# Altium schematic sheet Sh3_Power.SchDoc
size A3
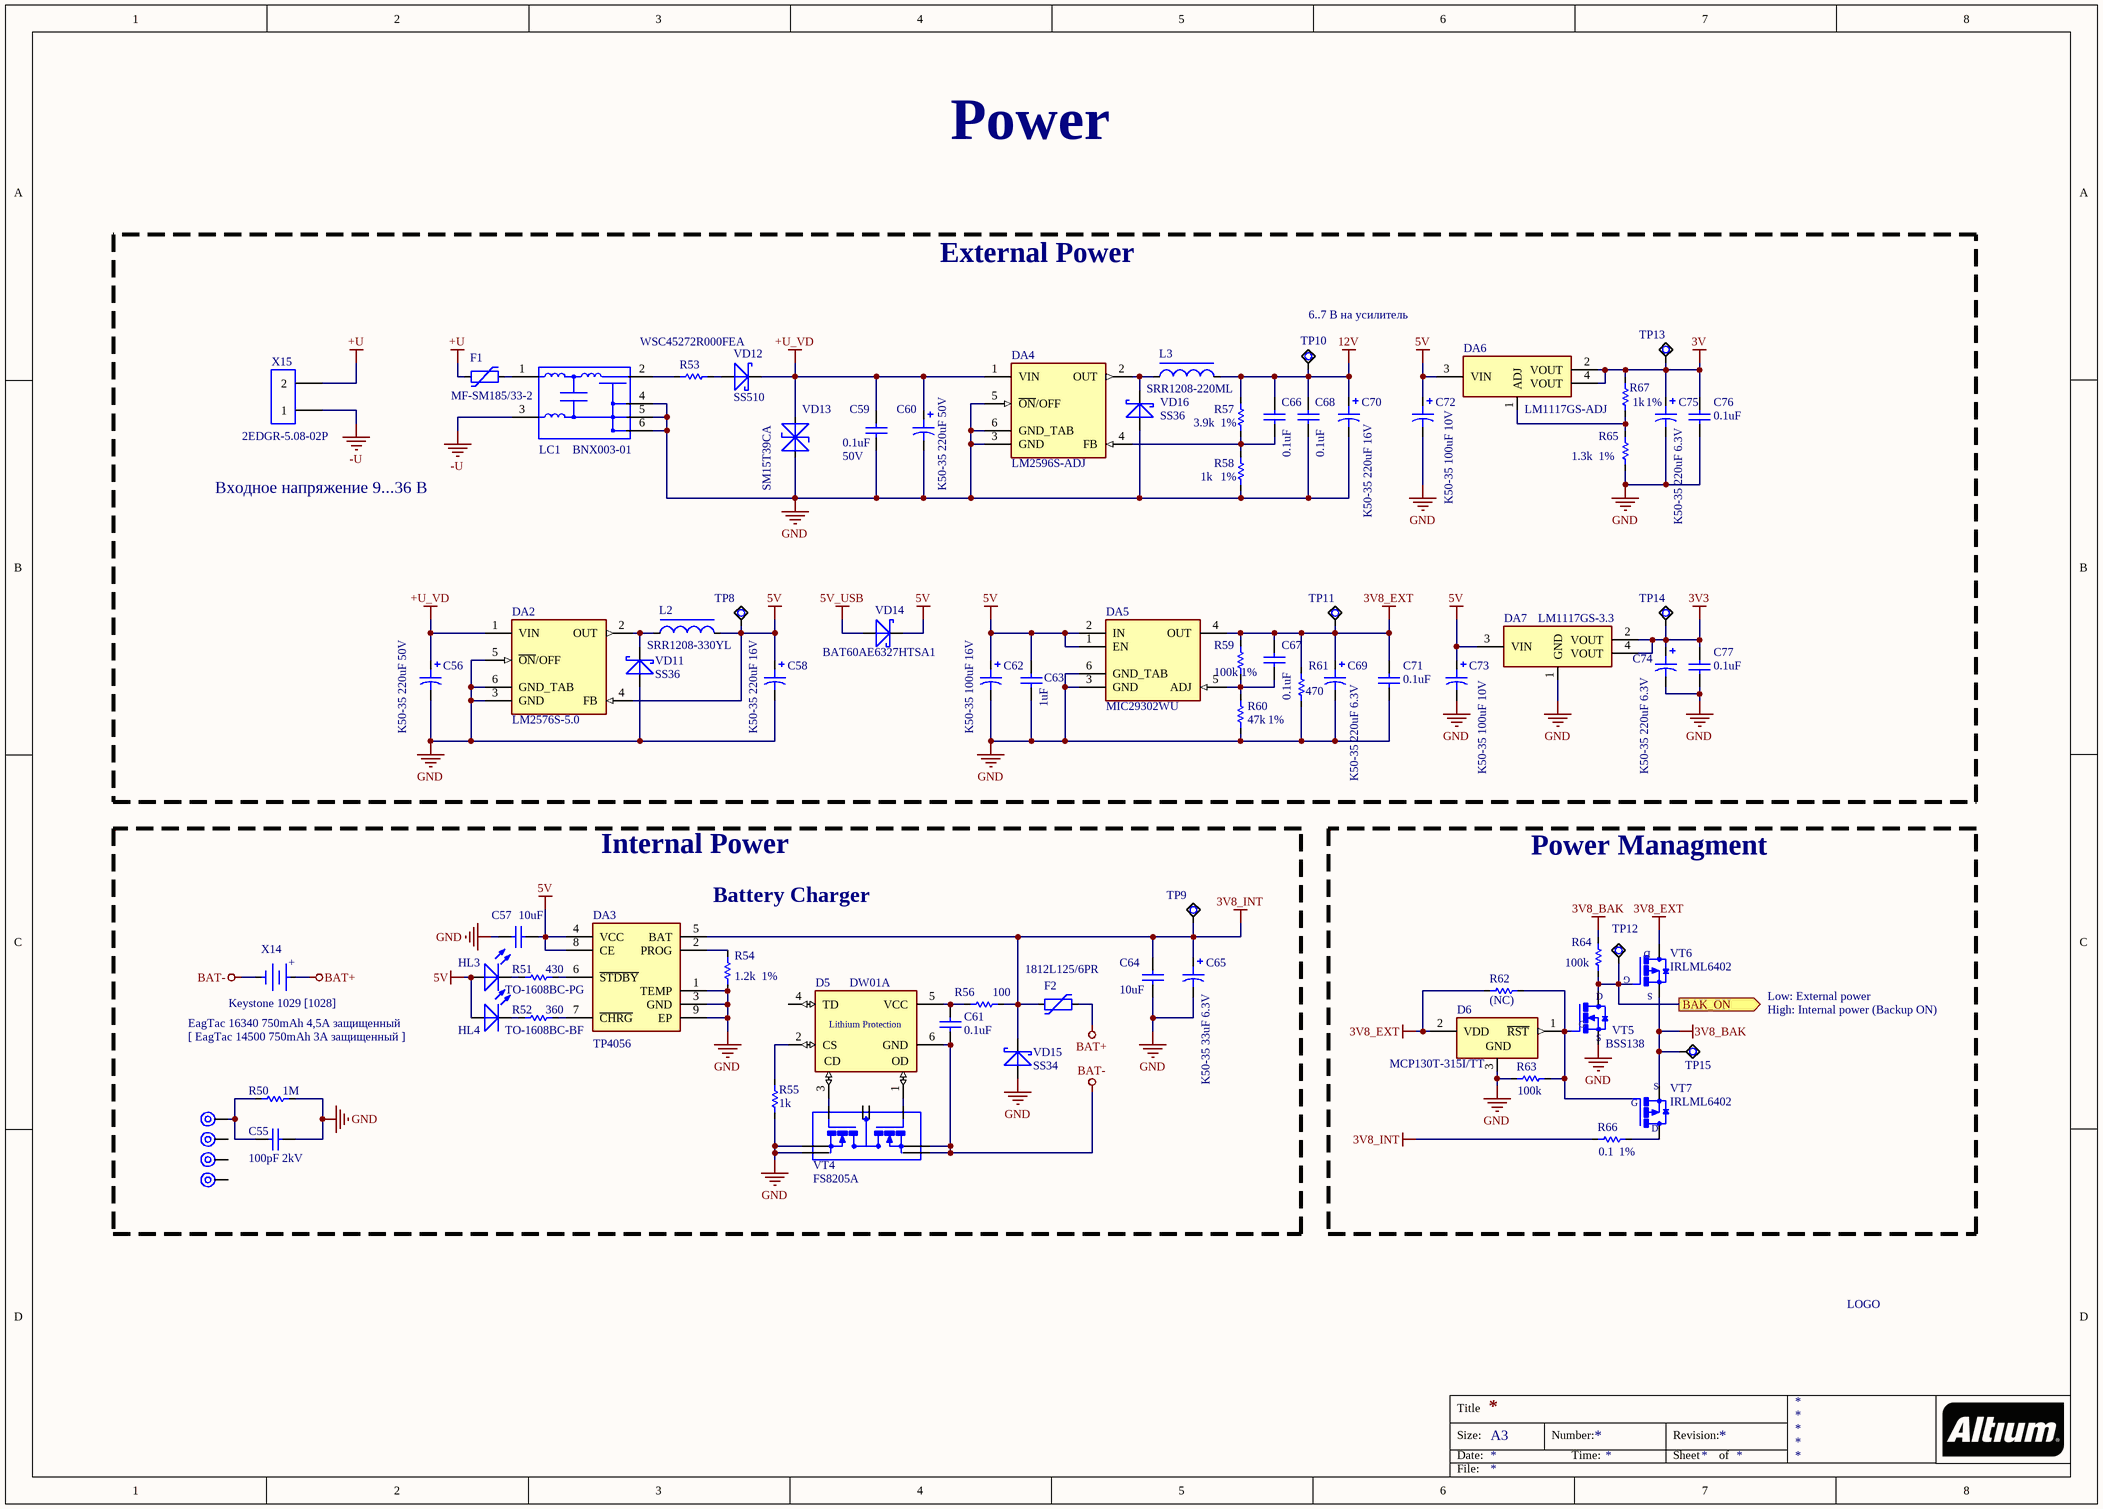
[diagram p0: Sh3_Power.SchDoc]

## Parts
BC1  Mounting Hole  [body_connection_1]  (value not drawn)
BC2  Mounting Hole  [body_connection_1]  (value not drawn)
BC3  Mounting Hole  [body_connection_1]  (value not drawn)
BC4  Mounting Hole  [body_connection_1]  (value not drawn)
C55  100pF 2kV  [C_SMD1206]
C56  K50-35 220uF 50V  [K50-35 10x12.5x5]
C57  10uF  [C_SMD0603]
C58  K50-35 220uF 16V  [K50-35 6.3x11x2.5]
C59  0.1uF  [C_SMD0603]
C60  K50-35 220uF 50V  [K50-35 10x12.5x5]
C61  0.1uF  [C_SMD0603]
C62  K50-35 100uF 16V  [K50-35 6.3x11x2.5]
C63  1uF  [C_SMD0603]
C64  10uF  [C_SMD0603]
C65  K50-35 33uF 6.3V  [K50-35mini 4x7x2]
C66  0.1uF  [C_SMD0603]
C67  0.1uF  [C_SMD0603]
C68  0.1uF  [C_SMD0603]
C69  K50-35 220uF 6.3V  [K50-35 6.3x11x2.5]
C70  K50-35 220uF 16V  [K50-35 6.3x11x2.5]
C71  0.1uF  [C_SMD0603]
C72  K50-35 100uF 10V  [K50-35 5x11x2]
C73  K50-35 100uF 10V  [K50-35 5x11x2]
C74  K50-35 220uF 6.3V  [K50-35 6.3x11x2.5]
C75  K50-35 220uF 6.3V  [K50-35 6.3x11x2.5]
C76  0.1uF  [C_SMD0603]
C77  0.1uF  [C_SMD0603]
D5  DW01A  [SOT23-6-D]
D6  MCP130T-315I/TT  [SOT23-3]
DA2  LM2576S-5.0  [TO263-5]
DA3  TP4056  [SOIC127P600X175-9N]
DA4  LM2596S-ADJ  [TO263-5]
DA5  MIC29302WU  [TO263-5 - heatsink]
DA6  LM1117GS-ADJ  [SOT223]
DA7  LM1117GS-3.3  [SOT223]
F1  MF-SM185/33-2  [FUSM8867X300N]
F2  1812L125/6PR  [FUSSC324X455X62L]
HL3  TO-1608BC-PG  [LED_SMD1608GREEN]
HL4  TO-1608BC-BF  [LED_SMD1608]
L2  SRR1208-330YL  [SRR1208]
L3  SRR1208-220ML  [SRR1208]
LC1  BNX003-01  [Murata_BNX_L12MM5_W11MM5_T13MM0_MFG]
N1  Logo  [LOGO_SS]  (value not drawn)
R50  1M  [R_SMD1206]
R51  430  [R_SMD0603]
R52  360  [R_SMD0603]
R53  WSC45272R000FEA  [R_SMD4527]
R54  1.2k  [R_SMD0603]
R55  1k  [R_SMD0603]
R56  100  [R_SMD0603]
R57  3.9k  [R_SMD0603]
R58  1k  [R_SMD0603]
R59  100k  [R_SMD0603]
R60  47k  [R_SMD0603]
R61  470  [R_SMD0805]
R62  (NC)  [R_SMD0603]
R63  100k  [R_SMD0603]
R64  100k  [R_SMD0603]
R65  1.3k  [R_SMD0603]
R66  0.1  [R_SMD0805]
R67  1k  [R_SMD0603]
TP8  Test_point  [TEST_POINT]  (value not drawn)
TP9  Test_point  [TEST_POINT]  (value not drawn)
TP10  Test_point  [TEST_POINT]  (value not drawn)
TP11  Test_point  [TEST_POINT]  (value not drawn)
TP12  Test_point  [TEST_POINT]  (value not drawn)
TP13  Test_point  [TEST_POINT]  (value not drawn)
TP14  Test_point  [TEST_POINT]  (value not drawn)
TP15  Test_point  [TEST_POINT]  (value not drawn)
VD11  SS36  [DO214AB SMC]
VD12  SS510  [SMC]
VD13  SM15T39CA  [DO214AB SMC]
VD14  BAT60AE6327HTSA1  [SOD-323]
VD15  SS34  [DO214AB SMC]
VD16  SS36  [DO214AB SMC]
VT4  FS8205A  [SOP65P640X120-8N]
VT5  BSS138  [SOT23-3]
VT6  IRLML6402  [SOT23]
VT7  IRLML6402  [SOT23]
X14  Keystone 1029 [1028]  [BAT_keystone1028+1029]
X15  2EDGR-5.08-02P  [2EDGR-5.08-02P]

## Blocks framed on the sheet
External Power: C56 C58-C60 C62 C63 C66-C77 DA2 DA4-DA7 F1 L2 L3 LC1 R53 R57-R61 R65 R67 TP8 TP10 TP11 TP13 TP14 VD11-VD14 VD16 X15
Internal Power: BC1-BC4 C55 C57 C61 C64 C65 D5 DA3 F2 HL3 HL4 R50-R52 R54-R56 TP9 VD15 VT4 X14
Power Managment: D6 R62-R64 R66 TP12 TP15 VT5-VT7

## Ports
BAK_ON (out)

## Nets
3V: C75.1 C76.1 DA6.2(VOUT) DA6.4(VOUT) R67.2(CW) TP13.1
3V3: C74.1 C77.1 DA7.2(VOUT) DA7.4(VOUT) TP14.1
3V8_BAK: R64.1(CCW) TP15.1 VT6.2(S) VT7.2(S)
3V8_EXT: C67.1 C69.1 C71.1 D6.2(VDD) DA5.4(OUT) R59.2(CW) R61.2(CW) R62.2(CW) TP11.1 VT6.3(D)
3V8_INT: C64.1 C65.1 DA3.5(BAT) F2.1 R56.1(CCW) R66.2(CW) TP9.1 VD15.2(NEG)
5V: C57.2 C58.1 C62.1 C63.1 C72.1 C73.1 DA2.4(FB) DA3.4(VCC) DA3.8(CE) DA5.1(EN) DA5.2(IN) DA6.3(VIN) DA7.3(VIN) HL3.1(POS) HL4.1(POS) L2.2 TP8.1 VD14.2(NEG)
5V_USB: VD14.1(POS)
12V: C66.1 C68.1 C70.1 L3.2 R57.2(CW) TP10.1
+U: F1.1 X15.2
+U_VD: C56.1 C59.1 C60.1 DA2.1(VIN) DA4.1(VIN) VD12.C(NEG) VD13.2(K)
-U: LC1.3(PSG) X15.1
BAT+: F2.2 X14.POS
BAT-: C61.2 D5.6(GND) VT4.2(S1_1) VT4.3(S1_2) X14.NEG
GND: C55.2 C56.2 C57.1 C58.2 C59.2 C60.2 C62.2 C63.2 C64.2 C65.2 C68.2 C69.2 C70.2 C71.2 C72.2 C73.2 C74.2 C75.2 C76.2 C77.2 D6.3(VSS) DA2.3(GND) DA2.5(~{ON}/OFF) DA2.6(GND_TAB) DA3.1(TEMP) DA3.3(GND) DA3.9(EP) DA4.3(GND) DA4.5(~{ON}/OFF) DA4.6(GND_TAB) DA5.3(GND) DA5.6(GND_TAB) DA7.1(GND) LC1.4(CG) LC1.5(CG) LC1.6(CG) R50.2(CW) R54.1(CCW) R55.2(CW) R58.1(CCW) R60.1(CCW) R61.1(CCW) R63.2(CW) R65.1(CCW) VD11.1(POS) VD13.1(A) VD15.1(POS) VD16.1(POS) VT4.6(S2_1) VT4.7(S2_2) VT5.2(S)
BAK_ON: R64.2(CW) TP12.1 VT5.3(D) VT6.1(G) ; port BAK_ON
NetBC1_1: BC1.1 C55.1 R50.1(CCW)
NetC61_1: C61.1 D5.5(VCC) R56.2(CW)
NetC66_2: C66.2 DA4.4(FB) R57.1(CCW) R58.2(CW)
NetC67_2: C67.2 DA5.5(ADJ) R59.1(CCW) R60.2(CW)
NetD5_1: D5.1(OD) VT4.4(G1)
NetD5_2: D5.2(CS) R55.1(CCW)
NetD5_3: D5.3(OC) VT4.5(G2)
NetD6_1: D6.1(~{RST}) R62.1(CCW) R63.1(CCW) VT5.1(G) VT7.1(G)
NetDA2_2: DA2.2(OUT) L2.1 VD11.2(NEG)
NetDA3_2: DA3.2(PROG) R54.2(CW)
NetDA3_6: DA3.6(~{STDBY}) R51.1(CCW)
NetDA3_7: DA3.7(~{CHRG}) R52.1(CCW)
NetDA4_2: DA4.2(OUT) L3.1 VD16.2(NEG)
NetDA6_1: DA6.1(ADJ) R65.2(CW) R67.1(CCW)
NetF1_2: F1.2 LC1.1(B)
NetHL3_2: HL3.2(NEG) R51.2(CW)
NetHL4_2: HL4.2(NEG) R52.2(CW)
NetLC1_2: LC1.2(CB) R53.1(CCW)
NetR53_2: R53.2(CW) VD12.A(POS)
NetR66_1: R66.1(CCW) VT7.3(D)

Not connected (* = marked no-connect by the designer): BC2 1; BC3 1; BC4 1; D5 4(TD); VT4 1(D12_1) 8(D12_2)

## Notes on the sheet
- Power
- 6..7 В на усилитель
- (near R57) 1%
- (near C75) 1%
- Входное напряжение 9...36 В
- (near C59) 50V
- (near R58) 1%
- (near R65) 1%
- (near R59) 1%
- 1%
- Battery Charger
- [ EagTac 14500 750mAh 3А защищенный ]
- (near X14) EagTac 16340 750mAh 4,5А защищенный
- Low: External power
- High: Internal power (Backup ON)
- (near R66) 1%
- Title
- Size:
- Date:
- A3
- Number:
- Time:
- Revision:
- Sheet
- of
- File:
- (in symbol Combo Battery Holder) +
- (in symbol DW01A) Lithium Protection; CD
- (in symbol Logo) LOGO
- (in symbol MCP130T-315I/TT) GND

## Library data of the parts
BC1-BC4 = BodyConnector
C55 = C_SMD: 1206 SMD Capacitor; ComponentLink1Description: elitan; ComponentLink1URL: https://www.elitan.ru/price/item16896874
C56 C58 C60 C62 C65 C69 C70 C72-C75 = K50-35: Конденсатор электролитический алюминиевый
  C56 C60: ComponentLink1Description: chipdip; ComponentLink1URL: https://www.chipdip.ru/product0/9000565903
  C58 C70: ComponentLink1Description: chipdip; ComponentLink1URL: https://www.chipdip.ru/product0/9000565899
  C62: ComponentLink1Description: chipdip; ComponentLink1URL: https://www.chipdip.ru/product0/9000565888
  C65: ComponentLink1Description: (К50-35 мини), 33 мкФ, 6.3 В, 4х7мм; ComponentLink1URL: https://www.chipdip.ru/product0/9000261769
  C69 C74 C75: ComponentLink1Description: (К50-35 мини), 220 мкФ, 6.3 В, 6.3х7мм; ComponentLink1URL: https://www.chipdip.ru/product0/9000261774?from=suggest_product
  C72 C73: ComponentLink1Description: chipdip-mini; ComponentLink1URL: https://www.chipdip.ru/product0/46079?from=suggest_product; ComponentLink2Description: chipdip; ComponentLink2URL: https://www.chipdip.ru/product0/9000565886
C57 C59 C61 C63 C64 C66-C68 C71 C76 C77 = C_SMD: 0603 SMD Capacitor; ComponentLink1Description: chipdip
  C57 C64: ComponentLink1URL: https://www.chipdip.ru/product/grm188r60j106me47d
  C59 C61 C66-C68 C71 C76 C77: ComponentLink1URL: https://www.chipdip.ru/product0/226236018
  C63: ComponentLink1URL: https://www.chipdip.ru/product/grm188r71e105ka12d
D5 = DW01A: Pushbutton Switch SPST-NC Standard Panel Mount, Front; MF: Fortune Semiconductor; Price: None; Availability: Unavailable; Package: Package Analog Devices; SnapEDA_Link: https://www.snapeda.com/parts/DW01A/Fortune%20Semiconductor/view-part/4388554/?ref=snap; MP: DW01A; Value: *; ComponentLink1Description: elitan; ComponentLink1URL: https://www.elitan.ru/price/item379006536; ComponentLink2Description: electronshik; ComponentLink2URL: https://www.electronshik.ru/item/FUMAN/DW01A
D6 = MCP130T-315I/TT: 3.15 V 150 ms Microcontroller Supervisory Circuit - SOT-23-3; MF: Microchip; Value: *; Availability: Unavailable; Price: None; MP: MCP130T-315I/TT; Package: SOT-23 Microchip; SnapEDA_Link: https://www.snapeda.com/parts/MCP130T-315I/TT/Microchip/view-part/12206/?ref=snap; ComponentLink1Description: chipdip; ComponentLink1URL: https://www.chipdip.ru/product0/8002395837; ComponentLink2Description: elitan; ComponentLink2URL: https://www.elitan.ru/price/item505437
DA2 = LM2576S: Импульсный понижающий регулятор напряжения, 5В, 3А, [TO-263]; ComponentLink1Description: 5V-chipdip; ComponentLink1URL: https://www.chipdip.ru/product/lm2576sx-5.0-nopb; ComponentLink2Description: 5V-elitan; ComponentLink2URL: https://www.elitan.ru/price/item100181
DA3 = TP4056: Li-lon Battery Charger  1A Standalone Linear with Thermal Regulation in SOP-8; Manufacturer_Name: NanJing Top Power; Datasheet Link: https://dlnmh9ip6v2uc.cloudfront.net/datasheets/Prototyping/TP4056.pdf; Height: 1.75mm; Manufacturer_Part_Number: TP4056; ComponentLink1Description: elitan; ComponentLink1URL: https://www.elitan.ru/price/item26170288; ComponentLink2Description: electonshik; ComponentLink2URL: https://www.electronshik.ru/item/YOUTAI/TP4056
DA4 = LM2596S: SIMPLE SWITCHER&#174; 4.5V to 40V, 3A Low Component Count Step-Down Regulator; ComponentLink1Description: chipdip; ComponentLink1URL: https://www.chipdip.ru/product/lm2596s-adj-nopb; ComponentLink2Description: elitan; ComponentLink2URL: https://www.elitan.ru/price/item100231
DA5 = MIC29302WU: 3A Fast Response LDO Regulator / Operating Input Voltage Range: 3V to 16V / 1.24V to 15V Adjustable Output Voltage; ComponentLink1Description: elitan; ComponentLink1URL: https://www.elitan.ru/price/item637427; ComponentLink2Description: chipdip; ComponentLink2URL: https://www.chipdip.ru/product0/8000649332; ComponentLink3Description: electronshik; ComponentLink3URL: https://www.electronshik.ru/item/MCRCH/MIC29302WU
DA6 = LM1117GS-ADJ: LDO +1.25...13.8 В, 1А [SOT-223] / Линейный регулятор с низким падением напряжения, Максимальное входное напряжение, 20 В; ComponentLink1Description: chipdip; ComponentLink1URL: https://www.chipdip.ru/product/lm1117gs-adj; ComponentLink2Description: elitan; ComponentLink2URL: https://www.elitan.ru/price/item21580115
DA7 = LM1117GS-3.3: LDO +3.3 В, 1А [SOT-223] / Линейный регулятор с низким падением напряжения, Максимальное входное напряжение, 20 В; ComponentLink1Description: chipdip; ComponentLink1URL: https://www.chipdip.ru/product/lm1117gs-3.3; ComponentLink2Description: elitan; ComponentLink2URL: https://www.elitan.ru/price/item21580113
F1 = MF-SM185/33-2: Самовосстанавливающийся предохранитель PTC 1.8A(hold) 3.6A(trip) 33VDC 40A 1.9W 5s 0.04Ohm SMD 3425 Solder Pad 9.5 X 6.71 X 3mm; ComponentLink1Description: elitan; ComponentLink1URL: https://www.elitan.ru/price/item781521; ComponentLink2Description: chipdip; ComponentLink2URL: https://www.chipdip.ru/product0/8001787493?from=suggest_product
F2 = 1812L125/6PR: Предохранитель SMD 6 VDC 2.5 A; ComponentLink1Description: elitan; ComponentLink1URL: https://www.elitan.ru/price/item387111
HL3 HL4 = LED_SMD: Vf =2 V, 20mA, 0603 / TO-1608BC-BF \  TO-1608BC-MRE
  HL3: ComponentLink1Description: chipdip-green-smd; ComponentLink1URL: https://www.chipdip.ru/product/to-1608bc-pg?from=suggest_product; ComponentLink2Description: elitan-green-smd; ComponentLink2URL: https://www.elitan.ru/price/item16986058
  HL4: ComponentLink1Description: chipdip-blue-smd; ComponentLink1URL: https://www.chipdip.ru/product/to-1608bc-bf?from=suggest_product; ComponentLink2Description: elitan-blue-smd; ComponentLink2URL: https://www.elitan.ru/price/item16986057
L2 L3 = SRR1208-330YL: SMD индуктивность проволочная, на ферритовом сердечнике, экранированная 33uH 15% 1KHz 23Q-Factor Ferrite 2.8A 62mOhm; ComponentLink1Description: chipdip; ComponentLink1URL: https://www.chipdip.ru/product/srr1208-330yl?from=suggest_product; ComponentLink2Description: elitan; ComponentLink2URL: https://www.elitan.ru/price/item319349
  L3: ComponentLink3Description: 22uH-elitan; ComponentLink3URL: https://www.elitan.ru/price/item437369
LC1 = BNX003-01: EMI фильтр индуктивно-емкостной 10A 150VDC 40дБ; ComponentLink1Description: elitan; ComponentLink1URL: https://www.elitan.ru/price/item279156; ComponentLink2Description: chipdip; ComponentLink2URL: https://www.chipdip.ru/product/bnx003-01?from=suggest_product
N1 = Logo: Print on PCB mask
R50 = R_SMD: 1206 SMD Resistor; ComponentLink1Description: chipdip; ComponentLink1URL: https://www.chipdip.ru/product0/690816980
R51 R52 R55 R56 R62-R64 = R_SMD: 0603 SMD Resistor
  R51: ComponentLink1Description: chipdip; ComponentLink1URL: https://www.chipdip.ru/product0/9000079667
  R52: ComponentLink1Description: chipdip; ComponentLink1URL: https://www.chipdip.ru/product0/9000079629
  R55: ComponentLink1Description: chipdip; ComponentLink1URL: https://www.chipdip.ru/product0/9000079676
  R56: ComponentLink1Description: chipdip; ComponentLink1URL: https://www.chipdip.ru/product0/9000079616
  R63 R64: ComponentLink1Description: chipdip; ComponentLink1URL: https://www.chipdip.ru/product0/9000079760
R53 = WSC45272R000FEA: SMD чип резистор, с проволочной обмоткой, 4527, 2 Ом, Серия WSC, 2 Вт; ComponentLink1Description: chipdip; ComponentLink1URL: https://www.chipdip.ru/product/wsc45272r000fea?from=suggest_product; ComponentLink2Description: elitan; ComponentLink2URL: https://www.elitan.ru/price/item572273
R54 R57-R60 R65 R67 = R_SMD: 0603 SMD Resistor 1%; ComponentLink1Description: chipdip
  R54: ComponentLink1URL: https://www.chipdip.ru/product0/9000079678
  R57: ComponentLink1URL: https://www.chipdip.ru/product0/9000079726
  R58 R67: ComponentLink1URL: https://www.chipdip.ru/product0/9000079676
  R59: ComponentLink1URL: https://www.chipdip.ru/product0/9000079760
  R60: ComponentLink1URL: https://www.chipdip.ru/product0/9000079752
  R65: ComponentLink1URL: https://www.chipdip.ru/product0/9000079679
R61 = R_SMD: 0805 SMD Resistor; ComponentLink1Description: chipdip; ComponentLink1URL: https://www.chipdip.ru/product0/9000079478
R66 = R_SMD: 0805 SMD Resistor 1%; ComponentLink1Description: elitan; ComponentLink1URL: https://www.elitan.ru/price/item503786
TP8-TP15 = Test_point: Test point for PCB
VD11 VD16 = SS36: Schottky; DO-214AB; 3.0A IF; 0.75V; 60V; 100A IFRM; 10000V/us; 1000pF; ComponentLink1Description: elitan; ComponentLink1URL: https://www.elitan.ru/price/item15648528; ComponentLink2Description: chipdip; ComponentLink2URL: https://www.chipdip.ru/product/ss36-e3-57t-2?from=suggest_product
VD12 = SS510: Диод Шоттки 5A 100V (SMC); ComponentLink1Description: chipdip; ComponentLink1URL: https://www.chipdip.ru/product0/8002382677?from=suggest_product; ComponentLink2Description: elitan; ComponentLink2URL: https://www.elitan.ru/price/item24826922
VD13 = SM15T39CA: TVS Diode Bi-Directional SM15T39CA 69.7V, 1500W, SMC 2-Pin; ComponentLink1Description: chipdip; ComponentLink1URL: https://www.chipdip.ru/product/sm15t39ca?from=suggest_product; ComponentLink2Description: elitan; ComponentLink2URL: https://www.elitan.ru/price/item636974
VD14 = BAT60AE6327HTSA1: Диод Шоттки 3А 10В [SOD-323]; ComponentLink1Description: chipdip; ComponentLink1URL: https://www.chipdip.ru/product/bat60a?from=suggest_product; ComponentLink2Description: elitan; ComponentLink2URL: https://www.elitan.ru/price/item9533309
VD15 = SS34: Schottky; DO-214AB; 3.0A IF; 0.75V; 40V; 100A IFRM; 10000V/us; 1000pF; ComponentLink1Description: chipdip; ComponentLink1URL: https://www.chipdip.ru/product/ss34-5; ComponentLink2Description: elitan; ComponentLink2URL: https://www.elitan.ru/price/item9505516
VT4 = FS8205A: 20V 6A DUAL N-Channel MOSFET Transistor; Manufacturer_Name: SII Semiconductor; Datasheet Link: http://www.ic-fortune.com/upload/Download/FS8205A-DS-12_EN.pdf; Height: 1.2mm; Manufacturer_Part_Number: FS8205A; ComponentLink1Description: elitan; ComponentLink1URL: https://www.elitan.ru/price/item13487239; ComponentLink2Description: electronshik; ComponentLink2URL: https://www.electronshik.ru/item/FUXIN/FS8205A
VT5 = BSS138: MOSFET, N-канал, 0.2А, 50В, [SOT-23]; ComponentLink1Description: chipdip; ComponentLink1URL: https://www.chipdip.ru/product/bss138-7-f-diodes?from=suggest_product; ComponentLink2Description: elitan; ComponentLink2URL: https://www.elitan.ru/price/item305174
VT6 VT7 = IRLML6402: P-Channel 20V 3.7A _Ta_ 1.3W _Ta_ Surface Mount/SOT-23; MF: Infineon Technologies; Package: SC-59 Infineon Technologies; Value: *; Availability: Unavailable; SnapEDA_Link: https://www.snapeda.com/parts/IRLML6402/Infineon%20Technologies/view-part/2522811/?ref=snap; Price: None; MP: IRLML6402; ComponentLink1Description: chipdip; ComponentLink1URL: https://www.chipdip.ru/product/irlml6402tr?from=suggest_product; ComponentLink2Description: elitan; ComponentLink2URL: https://www.elitan.ru/price/item13518502
X14 = Combo Battery Holder: 16340 2/3A [14500 AA] Battery Holder; ComponentLink1Description: keystone1029-elitan; ComponentLink1URL: https://www.elitan.ru/price/item468733; ComponentLink2Description: keystone1028-elitan; ComponentLink2URL: https://www.elitan.ru/price/item535632; ComponentLink3Description: batteryholders; ComponentLink3URL: https://www.batteryholders.com/search.php?cat=Battery+Holder&num=&type=CR123A&term=&override=16340
X15 = 2EDGR-5.08-02P: Клеммник разъемный угловой 2 конт., шаг 5.08 мм / (KLS2-EDR-5.08-02P-4) / 2EDGK-5.08-02P - ответная часть; ComponentLink1Description: chipdip; ComponentLink1URL: https://www.chipdip.ru/product/kls2-edr-5.08-02p-4-2edgr-5.08-02p; ComponentLink2Description: elitan; ComponentLink2URL: https://www.elitan.ru/price/item21239767; ComponentLink3Description: ответная-часть; ComponentLink3URL: https://www.elitan.ru/price/item130957; ComponentLink4Description: на-кабель; ComponentLink4URL: https://www.chipdip.ru/product/kls2-edk-5.08-02p-4s-2esdv-02p?from=suggest_product